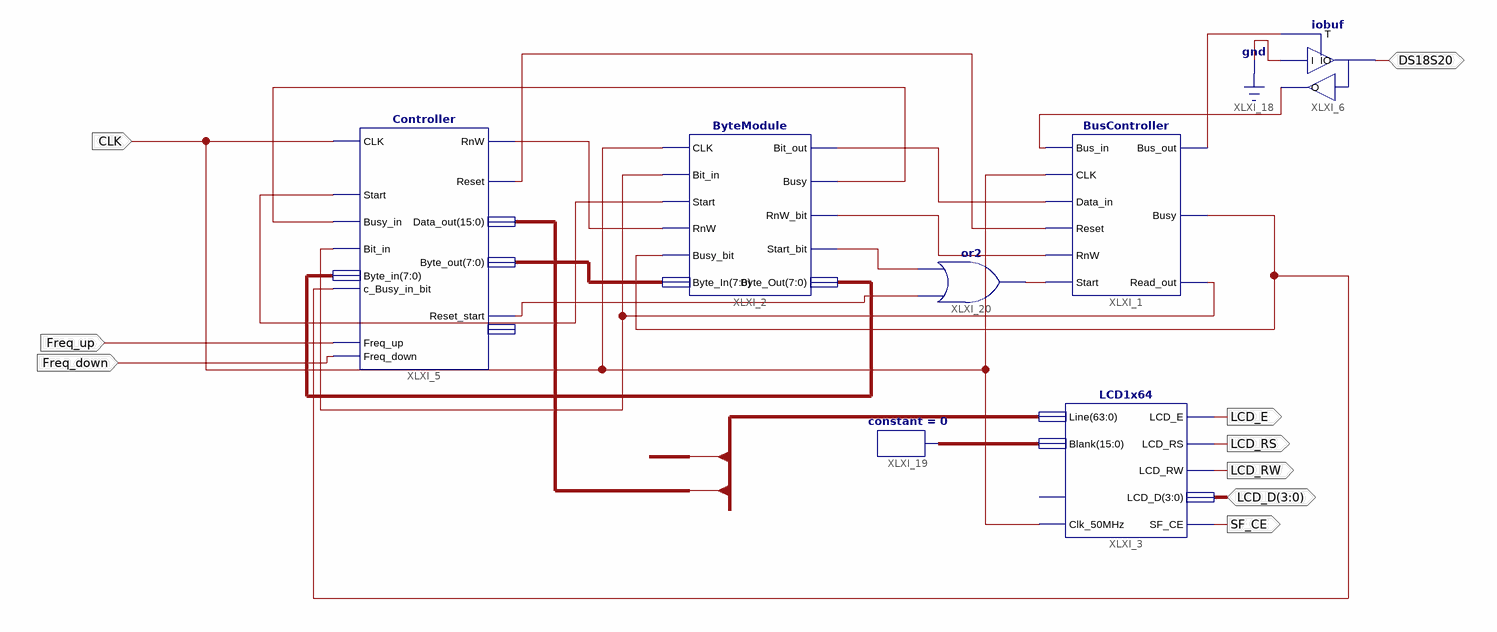
[diagram p0: schematic sheet 1]
// Xilinx ISE schematic Init_Test.sch (spartan3e) as structural Verilog: 7 symbols, 9 ports
module Init_Test (
  input  CLK,
  input  Freq_up,
  input  Freq_down,
  inout  DS18S20,
  inout  [3:0] LCD_D,
  output LCD_E,
  output LCD_RS,
  output LCD_RW,
  output SF_CE
);

  wire XLXN_1, XLXN_2, XLXN_10, XLXN_12, XLXN_13, XLXN_24, XLXN_25, XLXN_142, XLXN_145, XLXN_167, XLXN_178,
       XLXN_179, XLXN_180;
  wire [7:0] XLXN_19, XLXN_140;
  wire [15:0] XLXN_146;
  wire [63:0] Line;

  Controller XLXI_5 (
    .CLK(CLK), .Freq_up(Freq_up), .Freq_down(Freq_down), .Busy_in(XLXN_13), .c_Busy_in_bit(XLXN_167),
    .Bit_in(XLXN_145), .Byte_in(XLXN_140), .Start(XLXN_12), .RnW(XLXN_10), .Reset(XLXN_24),
    .Reset_start(XLXN_178), .Data_out(Line[15:0]), .Byte_out(XLXN_19));  // open: Freq_state
  ByteModule XLXI_2 (
    .CLK(CLK), .Bit_in(XLXN_145), .Start(XLXN_12), .RnW(XLXN_10), .Busy_bit(XLXN_167), .Byte_In(XLXN_19),
    .Bit_out(XLXN_1), .Busy(XLXN_13), .RnW_bit(XLXN_2), .Start_bit(XLXN_179), .Byte_Out(XLXN_140));
  LCD1x64 XLXI_3 (
    .Clk_50MHz(CLK), .Line(Line), .Blank(XLXN_146), .LCD_D(LCD_D), .LCD_E(LCD_E), .LCD_RW(LCD_RW),
    .LCD_RS(LCD_RS), .SF_CE(SF_CE));  // open: Reset
  BusController XLXI_1 (
    .Bus_in(XLXN_25), .CLK(CLK), .Data_in(XLXN_1), .Reset(XLXN_24), .RnW(XLXN_2), .Start(XLXN_180),
    .Bus_out(XLXN_142), .Busy(XLXN_167), .Read_out(XLXN_145));
  iobuf XLXI_6 (.I(1'b0), .IO(DS18S20), .O(XLXN_25), .T(XLXN_142));
  constant #(.CValue("0")) XLXI_19 (.O(XLXN_146));
  or XLXI_20 (XLXN_180, XLXN_178, XLXN_179);
endmodule
